# EAGLE schematic mcb-enhancer (EAGLE 6.3)
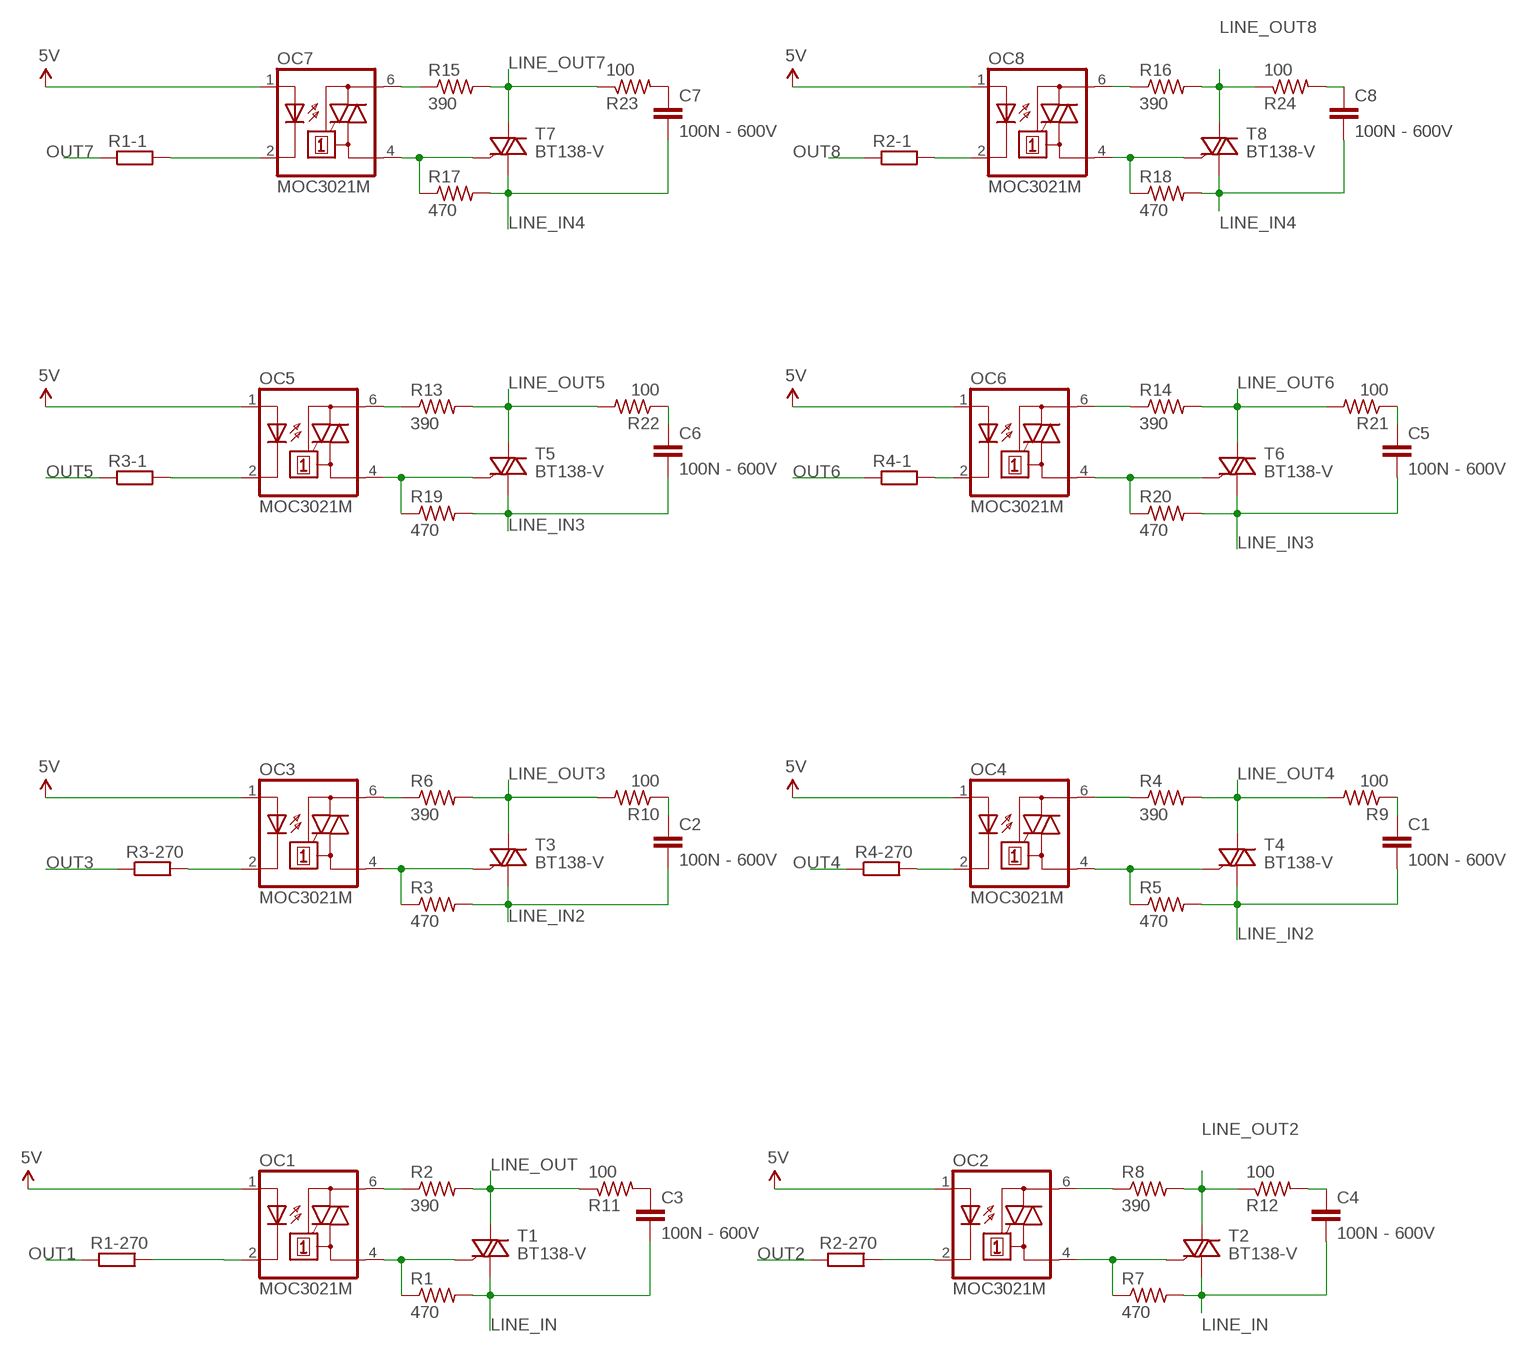
[diagram p0: schematic, sheet 1]

## Parts
C1  100N - 600V  C-EU050-030X075  [C050-030X075]
C2  100N - 600V  C-EU050-030X075  [C050-030X075]
C3  100N - 600V  C-EU050-030X075  [C050-030X075]
C4  100N - 600V  C-EU050-030X075  [C050-030X075]
C5  100N - 600V  C-EU050-030X075  [C050-030X075]
C6  100N - 600V  C-EU050-030X075  [C050-030X075]
C7  100N - 600V  C-EU050-030X075  [C050-030X075]
C8  100N - 600V  C-EU050-030X075  [C050-030X075]
OC1  MOC3021M  [DIL06]
OC2  MOC3021M  [DIL06]
OC3  MOC3021M  [DIL06]
OC4  MOC3021M  [DIL06]
OC5  MOC3021M  [DIL06]
OC6  MOC3021M  [DIL06]
OC7  MOC3021M  [DIL06]
OC8  MOC3021M  [DIL06]
R1  470  R-US_0207/7  [0207/7]
R1-1  R-EU_0309/V  [0309V]
R1-270  R-EU_0309/V  [0309V]
R2  390  R-US_0207/7  [0207/7]
R2-1  R-EU_0309/V  [0309V]
R2-270  R-EU_0309/V  [0309V]
R3  470  R-US_0207/7  [0207/7]
R3-1  R-EU_0309/V  [0309V]
R3-270  R-EU_0309/V  [0309V]
R4  390  R-US_0207/7  [0207/7]
R4-1  R-EU_0309/V  [0309V]
R4-270  R-EU_0309/V  [0309V]
R5  470  R-US_0207/7  [0207/7]
R6  390  R-US_0207/7  [0207/7]
R7  470  R-US_0207/7  [0207/7]
R8  390  R-US_0207/7  [0207/7]
R9  100  R-US_0207/7  [0207/7]
R10  100  R-US_0207/7  [0207/7]
R11  100  R-US_0207/7  [0207/7]
R12  100  R-US_0207/7  [0207/7]
R13  390  R-US_0207/7  [0207/7]
R14  390  R-US_0207/7  [0207/7]
R15  390  R-US_0207/7  [0207/7]
R16  390  R-US_0207/7  [0207/7]
R17  470  R-US_0207/7  [0207/7]
R18  470  R-US_0207/7  [0207/7]
R19  470  R-US_0207/7  [0207/7]
R20  470  R-US_0207/7  [0207/7]
R21  100  R-US_0207/7  [0207/7]
R22  100  R-US_0207/7  [0207/7]
R23  100  R-US_0207/7  [0207/7]
R24  100  R-US_0207/7  [0207/7]
T1  BT138-V  [TO220BV]
T2  BT138-V  [TO220BV]
T3  BT138-V  [TO220BV]
T4  BT138-V  [TO220BV]
T5  BT138-V  [TO220BV]
T6  BT138-V  [TO220BV]
T7  BT138-V  [TO220BV]
T8  BT138-V  [TO220BV]

## Nets
5V: OC1.1(A) OC2.1(A) OC3.1(A) OC4.1(A) OC5.1(A) OC6.1(A) OC7.1(A) OC8.1(A)
LINE_IN: C3.2 C4.2 R1.2 R7.2 T1.T1(A1) T2.T1(A1)
LINE_IN2: C1.2 C2.2 R3.2 R5.2 T3.T1(A1) T4.T1(A1)
LINE_IN3: C5.2 C6.2 R19.2 R20.2 T5.T1(A1) T6.T1(A1)
LINE_IN4: C7.2 C8.2 R17.2 R18.2 T7.T1(A1) T8.T1(A1)
LINE_OUT: R2.2 R11.1 T1.T2(A2)
LINE_OUT2: R8.2 R12.1 T2.T2(A2)
LINE_OUT3: R6.2 R10.2 T3.T2(A2)
LINE_OUT4: R4.2 R9.2 T4.T2(A2)
LINE_OUT5: R13.2 R22.2 T5.T2(A2)
LINE_OUT6: R14.2 R21.2 T6.T2(A2)
LINE_OUT7: R15.2 R23.1 T7.T2(A2)
LINE_OUT8: R16.2 R24.1 T8.T2(A2)
N$1: OC1.6(A2) R2.1
N$2: OC4.6(A2) R4.1
N$3: OC3.4(A1) R3.1 T3.G
N$4: OC3.6(A2) R6.1
N$5: OC4.4(A1) R5.1 T4.G
N$6: R1-270.2
N$7: C1.1 R9.1
N$8: OC1.2(C)
N$9: C2.1 R10.1
N$10: C3.1 R11.2
N$11: OC1.4(A1) R1.1 T1.G
N$12: OC2.6(A2) R8.1
N$13: OC2.4(A1) R7.1 T2.G
N$14: OC5.6(A2) R13.1
N$15: OC2.2(C) R2-270.2
N$18: OC3.2(C) R3-270.2
N$19: OC4.2(C) R4-270.2
N$21: C4.1 R12.2
N$22: OC7.2(C) R1-1.2
N$24: OC8.2(C) R2-1.2
N$27: OC5.2(C) R3-1.2
N$28: OC6.2(C) R4-1.2
N$30: OC7.4(A1) R17.1 T7.G
N$31: OC8.6(A2) R16.1
N$32: OC8.4(A1) R18.1 T8.G
N$33: OC7.6(A2) R15.1
N$34: OC6.6(A2) R14.1
N$35: OC5.4(A1) R19.1 T5.G
N$36: OC6.4(A1) R20.1 T6.G
N$37: C5.1 R21.1
N$38: C6.1 R22.1
N$39: C7.1 R23.2
N$40: C8.1 R24.2
OUT1: R1-270.1
OUT2: R2-270.1
OUT3: R3-270.1
OUT4: R4-270.1
OUT5: R3-1.1
OUT6: R4-1.1
OUT7: R1-1.1
OUT8: R2-1.1

## Library data of the parts
C1-C8 = rcl:C-EU: CAPACITOR, European symbol
OC1-OC8 = optocoupler:MOC30*M: RANDOM-PHASE OPTOISOLATORS TRIAC DRIVER OUTPUT Source: http://www.fairchildsemi.com MOC3020-M.pdf; MF: FAIRCHILD SEMICONDUCTOR; MPN: MOC3021-M; OC_FARNELL: 1021365; OC_NEWARK: 95B7895
R1-R24 = rcl:R-US_: RESISTOR, American symbol
R1-1 R1-270 R2-1 R2-270 R3-1 R3-270 R4-1 R4-270 = rcl:R-EU_: RESISTOR, European symbol
T1-T8 = triac:BT138: TRIAC Source: http://www.semiconductors.philips.com BT138_SERIES_2.pdf